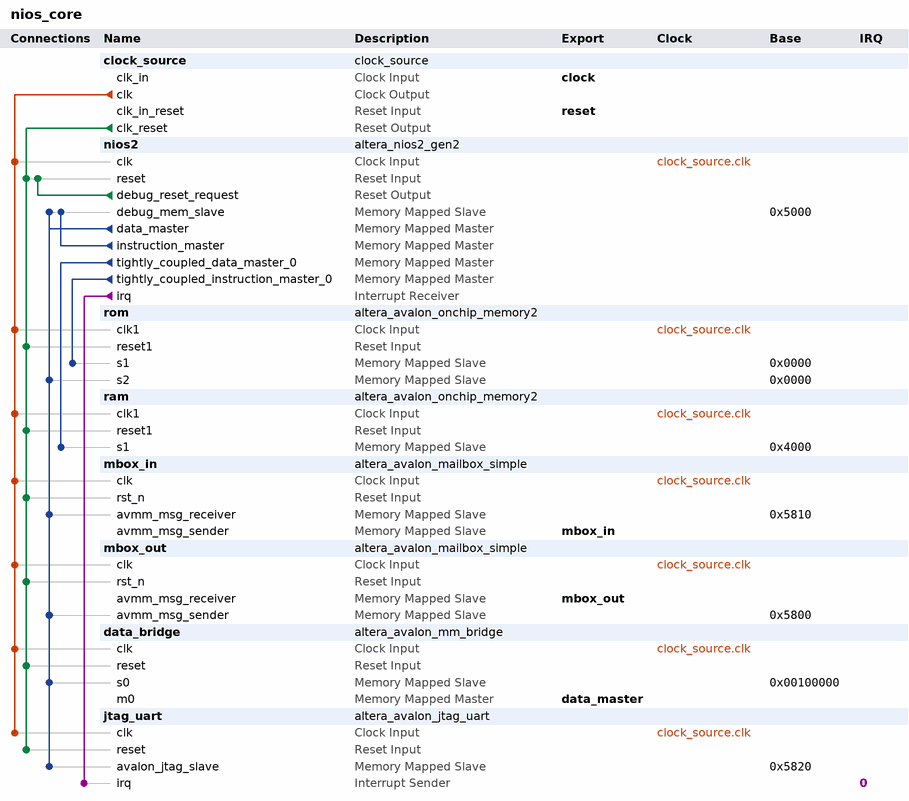
[diagram p0: system contents]
# Platform Designer (Qsys) system nios_core, Cyclone IV E EP4CE115F29C7
# Parameters at their usual value, and those the tool derives, are not listed.
package require -exact qsys 18.1
create_system nios_core
set_project_property DEVICE_FAMILY {Cyclone IV E}
set_project_property DEVICE EP4CE115F29C7

add_instance clock_source clock_source 18.1
set_instance_parameter_value clock_source clockFrequency 50000000

add_instance nios2 altera_nios2_gen2 18.1
set_instance_parameter_value nios2 dcache_bursts true
set_instance_parameter_value nios2 dcache_numTCDM 1
set_instance_parameter_value nios2 dcache_size 4096
set_instance_parameter_value nios2 exceptionSlave rom.s1
set_instance_parameter_value nios2 icache_burstType Sequential
set_instance_parameter_value nios2 icache_numTCIM 1
set_instance_parameter_value nios2 icache_size 0
set_instance_parameter_value nios2 impl Fast
set_instance_parameter_value nios2 resetSlave rom.s1

add_instance rom altera_avalon_onchip_memory2 18.1
set_instance_parameter_value rom dataWidth 32
set_instance_parameter_value rom dualPort true
set_instance_parameter_value rom initMemContent false
set_instance_parameter_value rom initializationFileName onchip_mem.hex
set_instance_parameter_value rom memorySize 16384
set_instance_parameter_value rom singleClockOperation true

add_instance ram altera_avalon_onchip_memory2 18.1
set_instance_parameter_value ram dataWidth 32
set_instance_parameter_value ram dualPort false
set_instance_parameter_value ram initMemContent false
set_instance_parameter_value ram initializationFileName onchip_mem.hex
set_instance_parameter_value ram memorySize 4096

add_instance mbox_in altera_avalon_mailbox_simple 18.1
set_instance_parameter_value mbox_in AWIDTH 2
set_instance_parameter_value mbox_in DWIDTH 32
set_instance_parameter_value mbox_in MSG_ARRIVAL_NOTIFY 0
set_instance_parameter_value mbox_in MSG_SPACE_NOTIFY 0

add_instance mbox_out altera_avalon_mailbox_simple 18.1
set_instance_parameter_value mbox_out AWIDTH 2
set_instance_parameter_value mbox_out DWIDTH 32
set_instance_parameter_value mbox_out MSG_ARRIVAL_NOTIFY 0
set_instance_parameter_value mbox_out MSG_SPACE_NOTIFY 0

add_instance data_bridge altera_avalon_mm_bridge 18.1
set_instance_parameter_value data_bridge ADDRESS_UNITS SYMBOLS
set_instance_parameter_value data_bridge ADDRESS_WIDTH 20
set_instance_parameter_value data_bridge DATA_WIDTH 32
set_instance_parameter_value data_bridge MAX_PENDING_RESPONSES 4
set_instance_parameter_value data_bridge USE_AUTO_ADDRESS_WIDTH 0

add_instance jtag_uart altera_avalon_jtag_uart 18.1
set_instance_parameter_value jtag_uart simInteractiveOptions NO_INTERACTIVE_WINDOWS

# connections
add_connection clock_source.clk data_bridge.clk clock
add_connection clock_source.clk jtag_uart.clk clock
add_connection clock_source.clk mbox_in.clk clock
add_connection clock_source.clk mbox_out.clk clock
add_connection clock_source.clk nios2.clk clock
add_connection clock_source.clk ram.clk1 clock
add_connection clock_source.clk rom.clk1 clock
add_connection clock_source.clk_reset data_bridge.reset reset
add_connection clock_source.clk_reset jtag_uart.reset reset
add_connection clock_source.clk_reset mbox_in.rst_n reset
add_connection clock_source.clk_reset mbox_out.rst_n reset
add_connection clock_source.clk_reset nios2.reset reset
add_connection clock_source.clk_reset ram.reset1 reset
add_connection clock_source.clk_reset rom.reset1 reset
add_connection nios2.debug_reset_request nios2.reset reset
add_connection nios2.data_master data_bridge.s0 avalon
set_connection_parameter_value nios2.data_master/data_bridge.s0 baseAddress 0x00100000
add_connection nios2.data_master jtag_uart.avalon_jtag_slave avalon
set_connection_parameter_value nios2.data_master/jtag_uart.avalon_jtag_slave baseAddress 0x5820
add_connection nios2.data_master mbox_in.avmm_msg_receiver avalon
set_connection_parameter_value nios2.data_master/mbox_in.avmm_msg_receiver baseAddress 0x5810
add_connection nios2.data_master mbox_out.avmm_msg_sender avalon
set_connection_parameter_value nios2.data_master/mbox_out.avmm_msg_sender baseAddress 0x5800
add_connection nios2.data_master nios2.debug_mem_slave avalon
set_connection_parameter_value nios2.data_master/nios2.debug_mem_slave baseAddress 0x5000
add_connection nios2.data_master rom.s2 avalon
set_connection_parameter_value nios2.data_master/rom.s2 baseAddress 0x0000
add_connection nios2.instruction_master nios2.debug_mem_slave avalon
set_connection_parameter_value nios2.instruction_master/nios2.debug_mem_slave baseAddress 0x5000
add_connection nios2.tightly_coupled_data_master_0 ram.s1 avalon
set_connection_parameter_value nios2.tightly_coupled_data_master_0/ram.s1 baseAddress 0x4000
add_connection nios2.tightly_coupled_instruction_master_0 rom.s1 avalon
set_connection_parameter_value nios2.tightly_coupled_instruction_master_0/rom.s1 baseAddress 0x0000
add_connection nios2.irq jtag_uart.irq interrupt
set_connection_parameter_value nios2.irq/jtag_uart.irq irqNumber 0

# exported interfaces
add_interface clock clock sink
set_interface_property clock EXPORT_OF clock_source.clk_in
add_interface data_master avalon master
set_interface_property data_master EXPORT_OF data_bridge.m0
add_interface mbox_in avalon slave
set_interface_property mbox_in EXPORT_OF mbox_in.avmm_msg_sender
add_interface mbox_out avalon slave
set_interface_property mbox_out EXPORT_OF mbox_out.avmm_msg_receiver
add_interface reset reset sink
set_interface_property reset EXPORT_OF clock_source.clk_in_reset

set_interconnect_requirement {$system} qsys_mm.clockCrossingAdapter HANDSHAKE
set_interconnect_requirement {$system} qsys_mm.enableEccProtection FALSE
set_interconnect_requirement {$system} qsys_mm.insertDefaultSlave FALSE
set_interconnect_requirement {$system} qsys_mm.maxAdditionalLatency 1

save_system nios_core.qsys
